# EAGLE design segundo_piso (EAGLE 7.6.0)
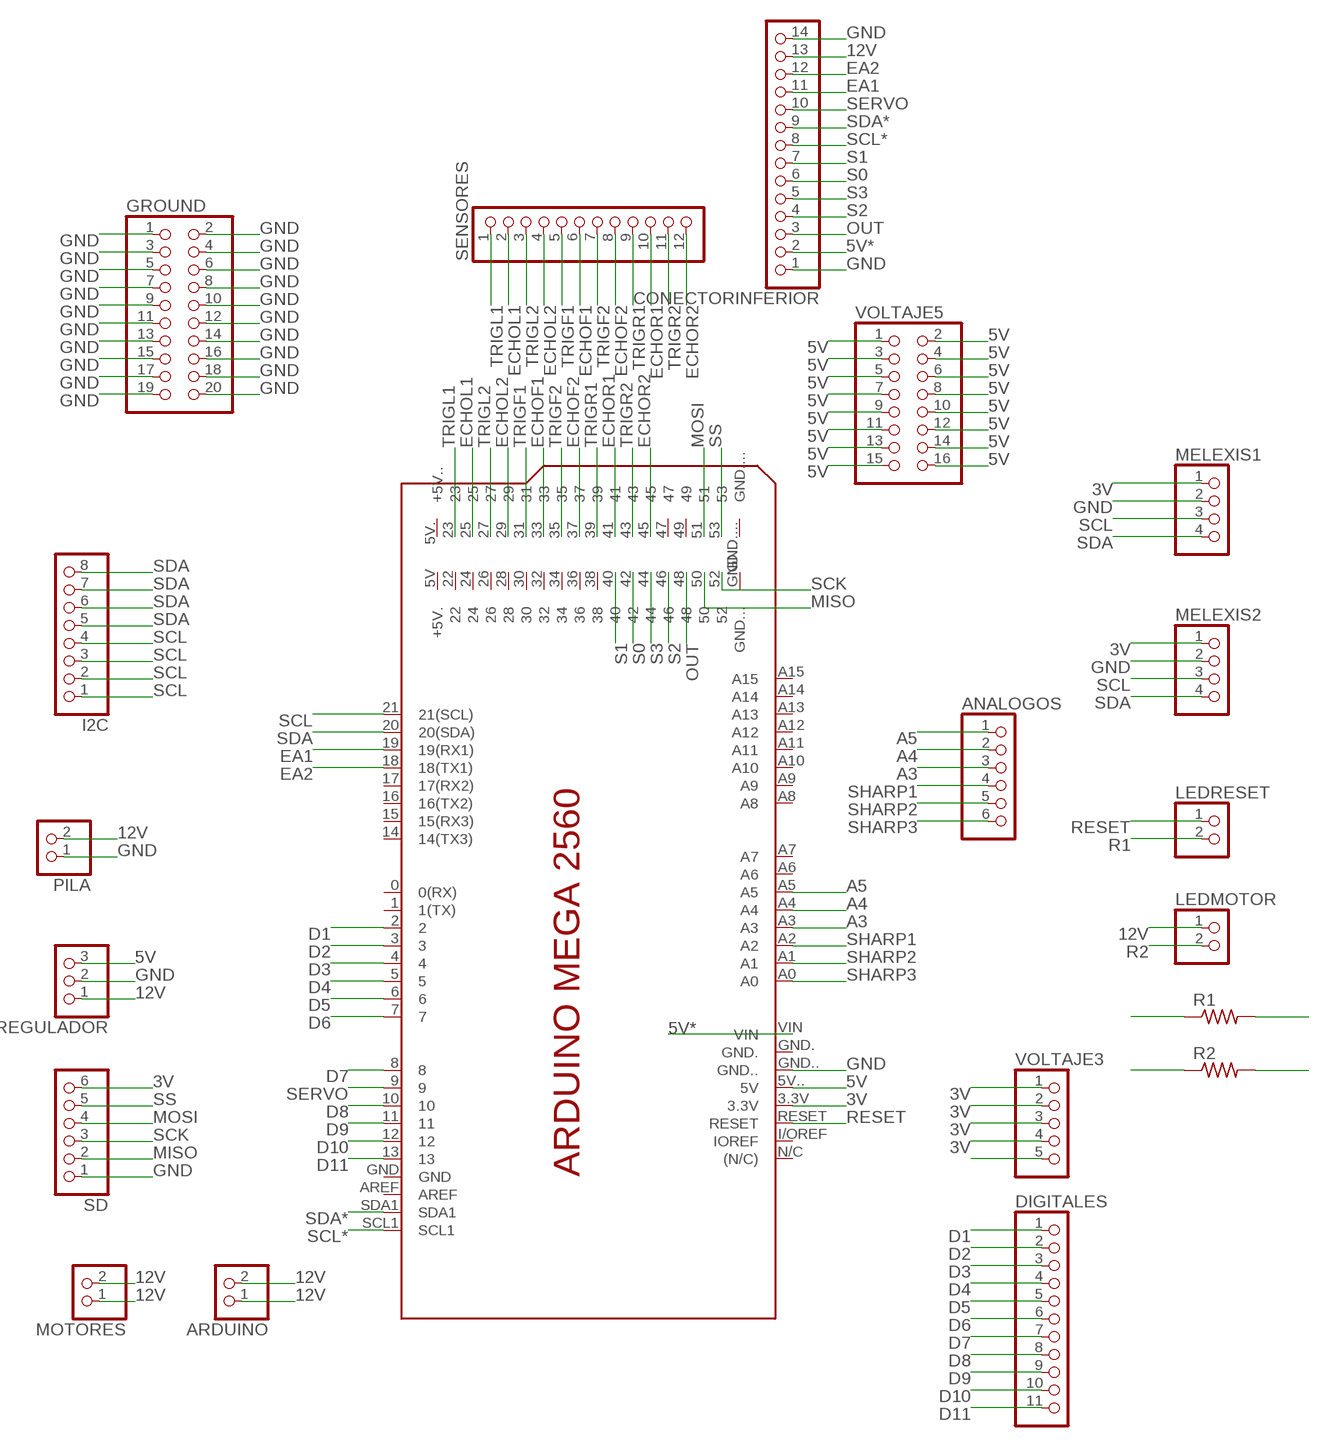
[diagram p0: schematic, sheet 1]

## Parts
ANALOGOS  PINHD-1X6  [1X06]
ARDUINO  PINHD-1X2  [1X02]
CONECTORINFERIOR  PINHD-1X14  [1X14]
DIGITALES  PINHD-1X11  [1X11]
GROUND  PINHD-2X10  [2X10]
I2C  PINHD-1X8  [1X08]
LEDMOTOR  PINHD-1X2  [1X02]
LEDRESET  PINHD-1X2  [1X02]
MEGA1  MEGA  [MEGA]
MELEXIS1  PINHD-1X4  [1X04]
MELEXIS2  PINHD-1X4  [1X04]
MOTORES  PINHD-1X2  [1X02]
PILA  PINHD-1X2  [1X02]
R1  R-US_0204/7  [0204/7]
R2  R-US_0204/7  [0204/7]
REGULADOR  PINHD-1X3  [1X03]
SD  PINHD-1X6  [1X06]
SENSORES  PINHD-1X12  [1X12]
VOLTAJE3  PINHD-1X5  [1X05]
VOLTAJE5  PINHD-2X8  [2X08]

## Nets
3V: MEGA1.3.3V MELEXIS1.1 MELEXIS2.1 SD.6 VOLTAJE3.1 VOLTAJE3.2 VOLTAJE3.3 VOLTAJE3.4
5V: MEGA1.5V..(5V) REGULADOR.3 VOLTAJE5.1 VOLTAJE5.2 VOLTAJE5.3 VOLTAJE5.4 VOLTAJE5.5 VOLTAJE5.6 VOLTAJE5.7 VOLTAJE5.8 VOLTAJE5.9 VOLTAJE5.10 VOLTAJE5.11 VOLTAJE5.12 VOLTAJE5.13 VOLTAJE5.14 VOLTAJE5.15 VOLTAJE5.16
5V*: CONECTORINFERIOR.2 MEGA1.VIN
12V: ARDUINO.1 ARDUINO.2 CONECTORINFERIOR.13 LEDMOTOR.1 MOTORES.1 MOTORES.2 PILA.2 REGULADOR.1
A3: ANALOGOS.3 MEGA1.A3
A4: ANALOGOS.2 MEGA1.A4
A5: ANALOGOS.1 MEGA1.A5
D1: DIGITALES.1 MEGA1.2
D2: DIGITALES.2 MEGA1.3
D3: DIGITALES.3 MEGA1.4
D4: DIGITALES.4 MEGA1.5
D5: DIGITALES.5 MEGA1.6
D6: DIGITALES.6 MEGA1.7
D7: DIGITALES.7 MEGA1.8
D8: DIGITALES.8 MEGA1.10
D9: DIGITALES.9 MEGA1.11
D10: DIGITALES.10 MEGA1.12
D11: DIGITALES.11 MEGA1.13
EA1: CONECTORINFERIOR.11 MEGA1.19(19(RX1))
EA2: CONECTORINFERIOR.12 MEGA1.18(18(TX1))
ECHOF1: MEGA1.33 SENSORES.6
ECHOF2: MEGA1.37 SENSORES.8
ECHOL1: MEGA1.25 SENSORES.2
ECHOL2: MEGA1.29 SENSORES.4
ECHOR1: MEGA1.41 SENSORES.10
ECHOR2: MEGA1.45 SENSORES.12
GND: CONECTORINFERIOR.1 CONECTORINFERIOR.14 GROUND.1 GROUND.2 GROUND.3 GROUND.4 GROUND.5 GROUND.6 GROUND.7 GROUND.8 GROUND.9 GROUND.10 GROUND.11 GROUND.12 GROUND.13 GROUND.14 GROUND.15 GROUND.16 GROUND.17 GROUND.18 GROUND.19 GROUND.20 MEGA1.GND.. MELEXIS1.2 MELEXIS2.2 PILA.1 R1.2 R2.2 REGULADOR.2 SD.1
MISO: MEGA1.50 SD.2
MOSI: MEGA1.51 SD.4
OUT: CONECTORINFERIOR.3 MEGA1.48
R1: LEDRESET.2 R1.1
R2: LEDMOTOR.2 R2.1
RESET: LEDRESET.1 MEGA1.RESET VOLTAJE3.5
S0: CONECTORINFERIOR.6 MEGA1.42
S1: CONECTORINFERIOR.7 MEGA1.40
S2: CONECTORINFERIOR.4 MEGA1.46
S3: CONECTORINFERIOR.5 MEGA1.44
SCK: MEGA1.52 SD.3
SCL: I2C.1 I2C.2 I2C.3 I2C.4 MEGA1.21(21(SCL)) MELEXIS1.3 MELEXIS2.3
SCL*: CONECTORINFERIOR.8 MEGA1.SCL1
SDA: I2C.5 I2C.6 I2C.7 I2C.8 MEGA1.20(20(SDA)) MELEXIS1.4 MELEXIS2.4
SDA*: CONECTORINFERIOR.9 MEGA1.SDA1
SERVO: CONECTORINFERIOR.10 MEGA1.9
SHARP1: ANALOGOS.4 MEGA1.A2
SHARP2: ANALOGOS.5 MEGA1.A1
SHARP3: ANALOGOS.6 MEGA1.A0
SS: MEGA1.53 SD.5
TRIGF1: MEGA1.31 SENSORES.5
TRIGF2: MEGA1.35 SENSORES.7
TRIGL1: MEGA1.23 SENSORES.1
TRIGL2: MEGA1.27 SENSORES.3
TRIGR1: MEGA1.39 SENSORES.9
TRIGR2: MEGA1.43 SENSORES.11
Unconnected: MEGA1.0(0(RX)) MEGA1.1(1(TX)) MEGA1.5V(+5V.) MEGA1.5V.(+5V..) MEGA1.14(14(TX3)) MEGA1.15(15(RX3)) MEGA1.16(16(TX2)) MEGA1.17(17(RX2)) MEGA1.22 MEGA1.24 MEGA1.26 MEGA1.28 MEGA1.30 MEGA1.32 MEGA1.34 MEGA1.36 MEGA1.38 MEGA1.47 MEGA1.49 MEGA1.A6 MEGA1.A7 MEGA1.A8 MEGA1.A9 MEGA1.A10 MEGA1.A11 MEGA1.A12 MEGA1.A13 MEGA1.A14 MEGA1.A15 MEGA1.AREF MEGA1.GND MEGA1.GND. MEGA1.GND... MEGA1.GND.... MEGA1.I/OREF(IOREF) MEGA1.N/C((N/C))

## Library data of the parts
ANALOGOS SD = pinhead:PINHD-1X6: PIN HEADER
ARDUINO LEDMOTOR LEDRESET MOTORES PILA = pinhead:PINHD-1X2: PIN HEADER
CONECTORINFERIOR = pinhead:PINHD-1X14: PIN HEADER
DIGITALES = pinhead:PINHD-1X11: PIN HEADER
GROUND = pinhead:PINHD-2X10: PIN HEADER
I2C = pinhead:PINHD-1X8: PIN HEADER
MEGA1 = ROBORREGOS:MEGA
MELEXIS1 MELEXIS2 = pinhead:PINHD-1X4: PIN HEADER
R1 R2 = resistor:R-US_: RESISTOR, American symbol
REGULADOR = pinhead:PINHD-1X3: PIN HEADER
SENSORES = pinhead:PINHD-1X12: PIN HEADER
VOLTAJE3 = pinhead:PINHD-1X5: PIN HEADER
VOLTAJE5 = pinhead:PINHD-2X8: PIN HEADER

## Board
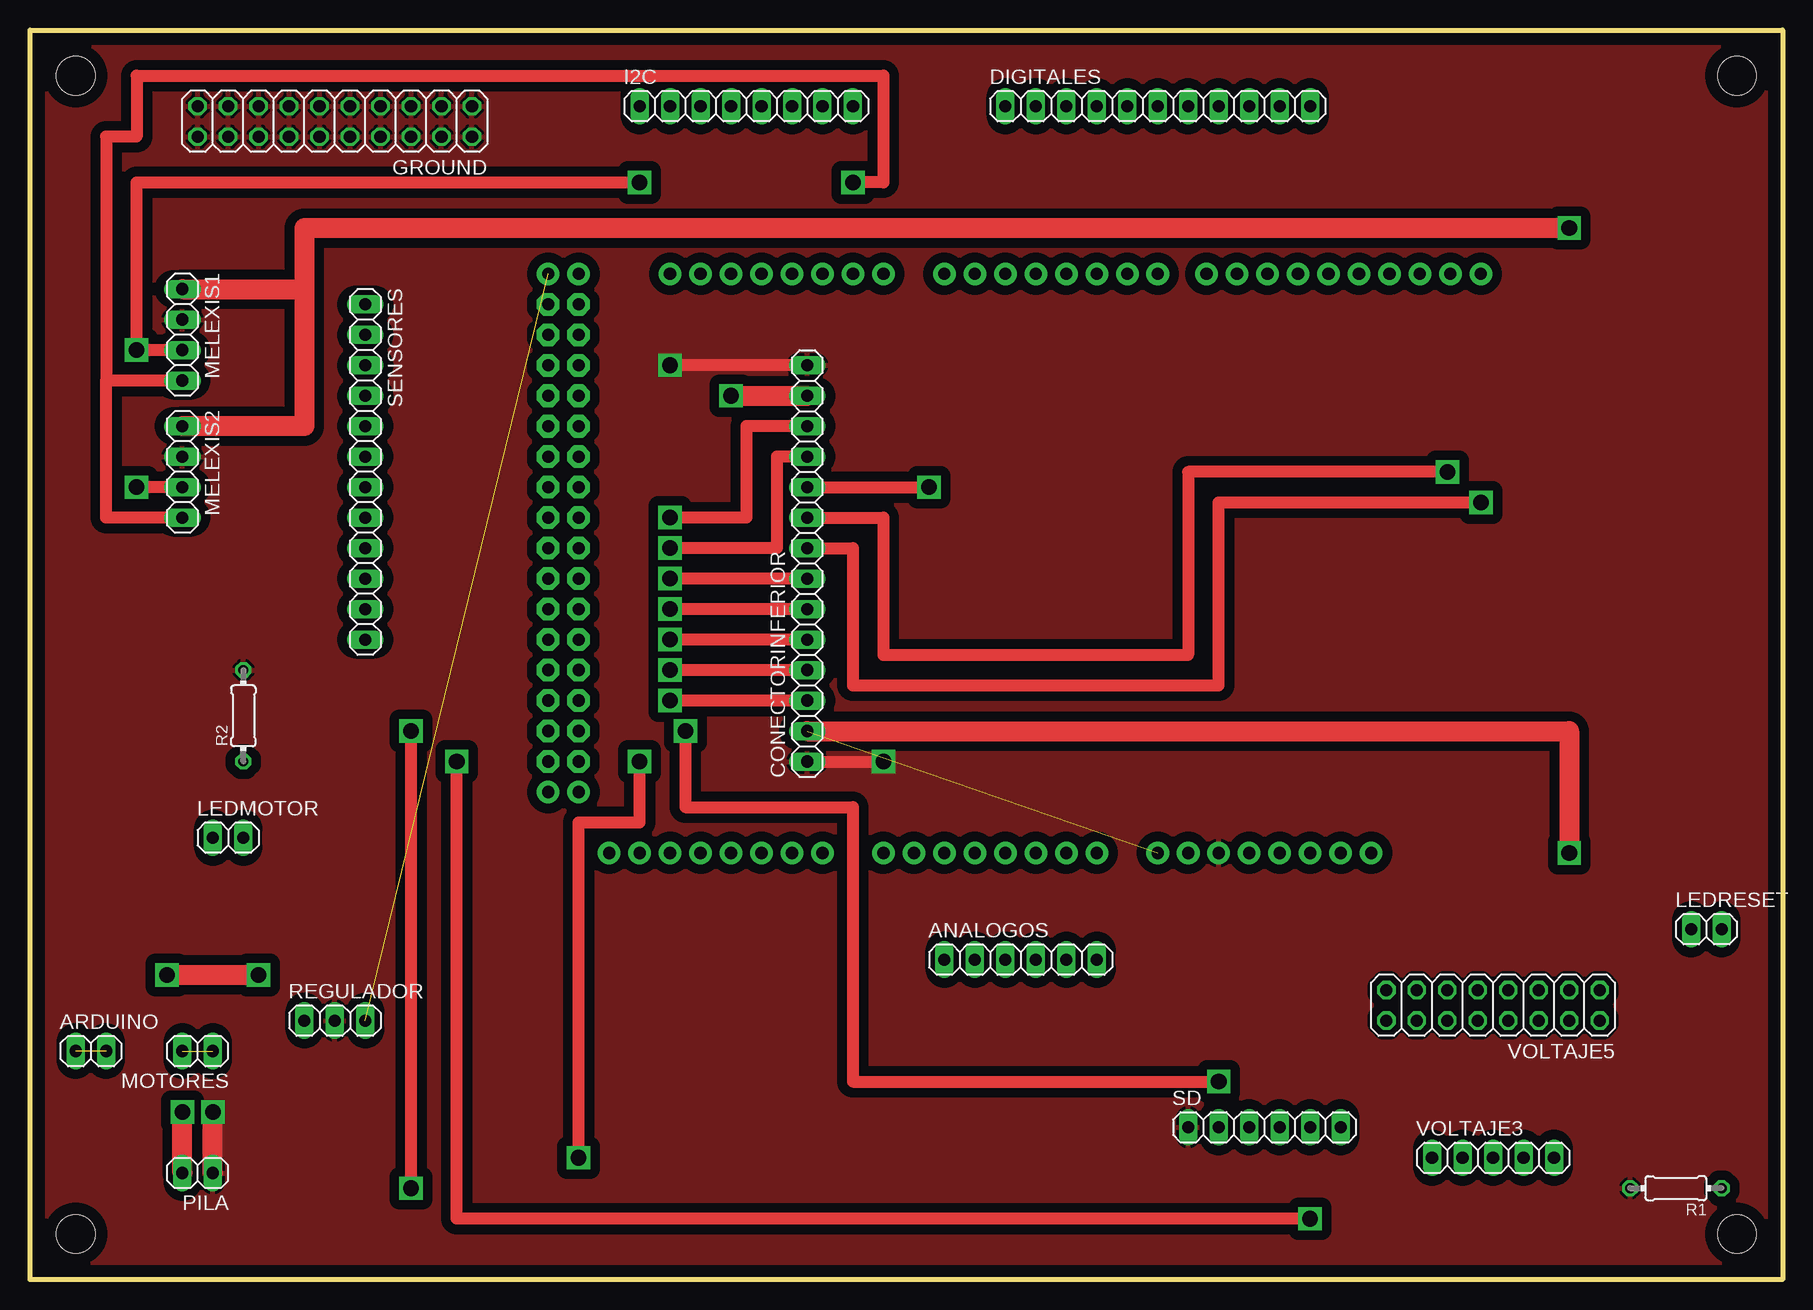
[diagram p1: board, top side]
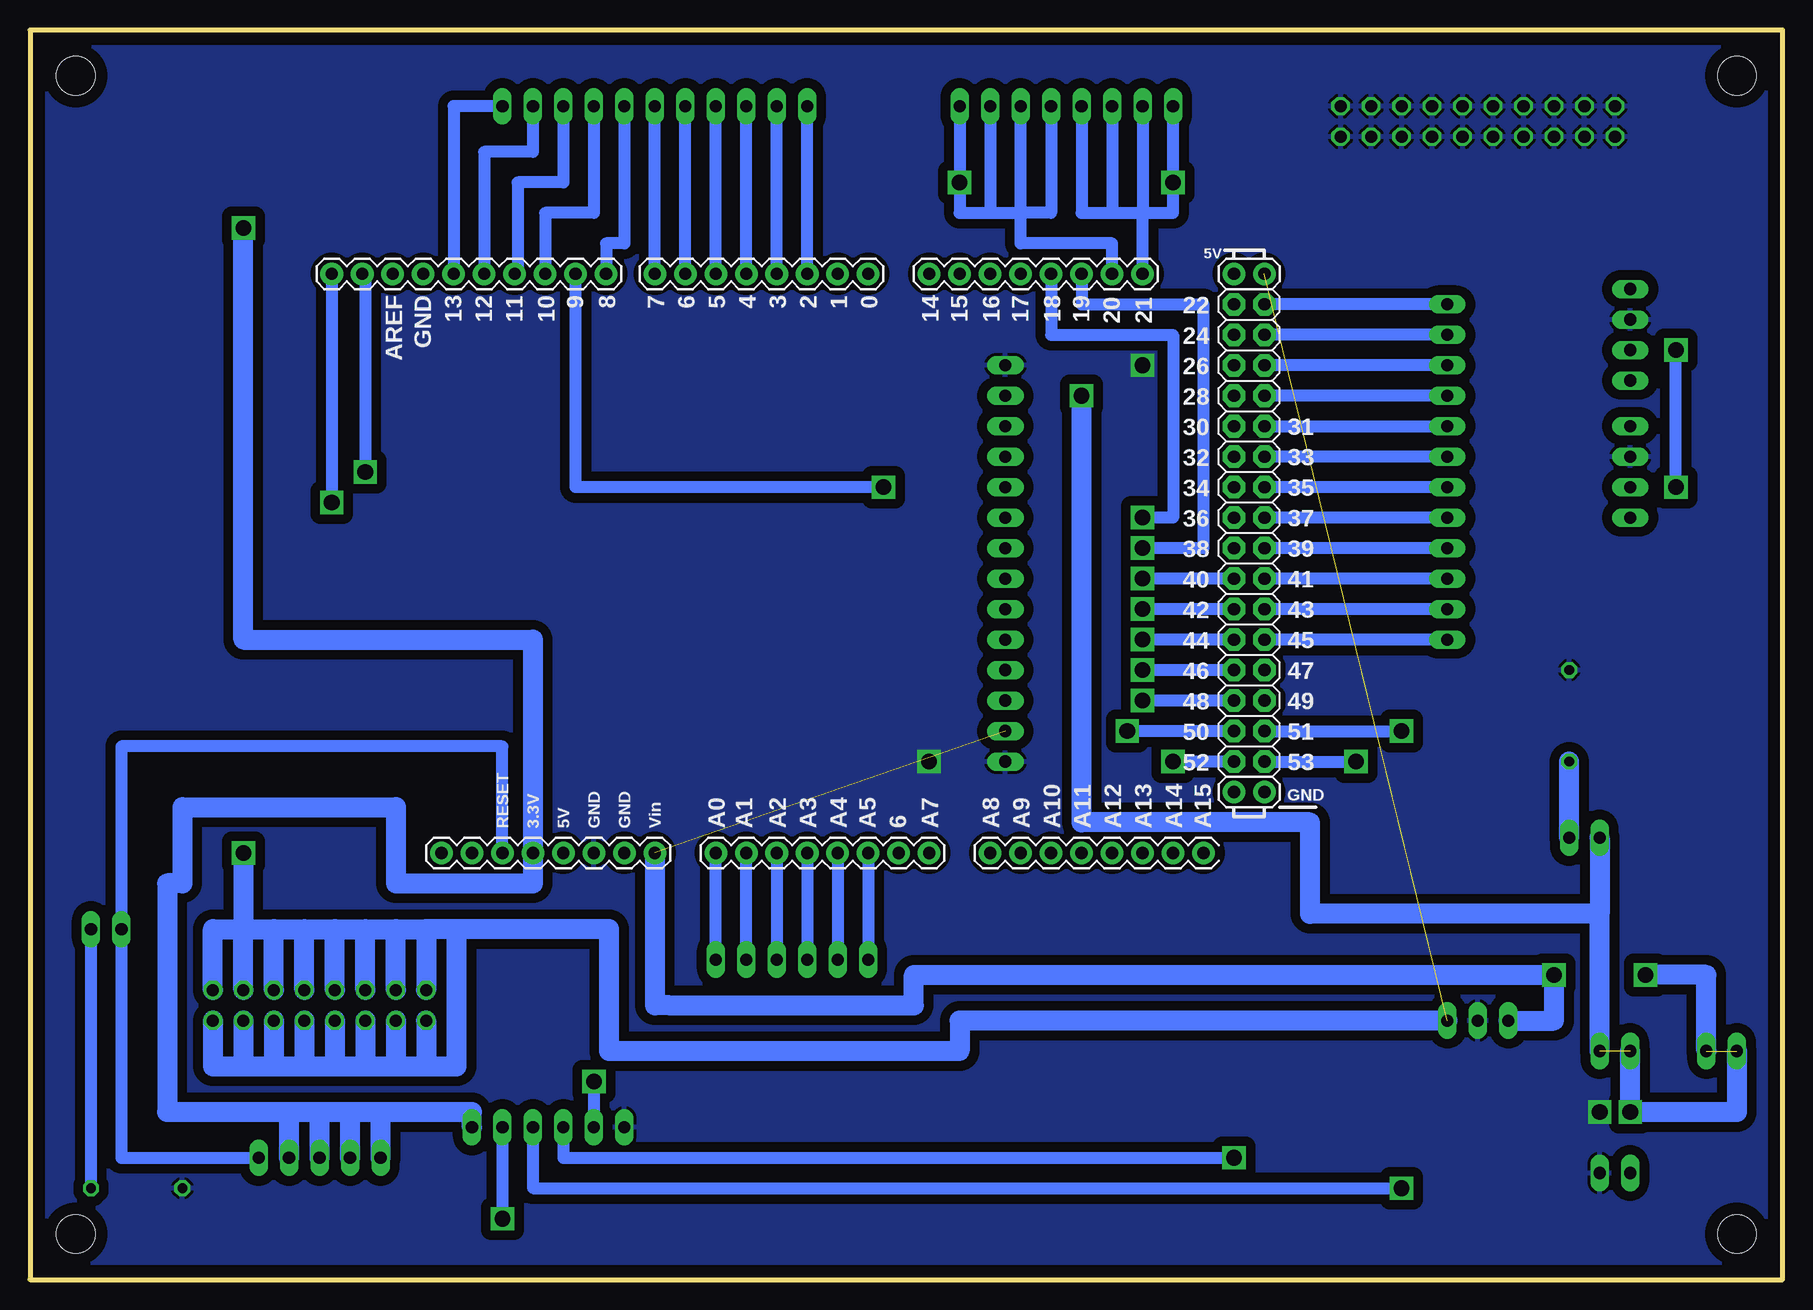
[diagram p2: board, bottom side, seen from below]

Size 146.05 x 104.14 mm. Coordinates in mm from the lower left corner, seen from the top.
Outline: 0,0 0,104.14 146.05,104.14 146.05,0 0,0
Copper layers (1*16): Top 0.035mm / dielectric 1.5mm / Bottom 0.035mm
Design rules "default": minimum track width 10mil, minimum drill 24mil, track to track 8mil, track to pad 8mil, pad to pad 8mil, via to via 8mil, smd to smd 8mil, copper to edge 40mil, drill to drill 8mil, minimum pad ring 10mil, minimum via ring 8mil, stop-mask expansion 4mil, vias tented up to drill 0mil, thermal gap 10mil
Holes 3.2 mm at 3.81,100.33 3.81,3.81 142.24,100.33 142.24,3.81

### Footprints (pad centres in the part's own frame; a part is rotated, then mirrored left to right if it is on the bottom)
1X06 = drill 1.016 long: 1 -6.35,0; 2 -3.81,0; 3 -1.27,0; 4 1.27,0; 5 3.81,0; 6 6.35,0
1X02 = drill 1.016 long: 1 -1.27,0; 2 1.27,0
1X14 = drill 1.016 long: 1 -16.51,0; 2 -13.97,0; 3 -11.43,0; 4 -8.89,0; 5 -6.35,0; 6 -3.81,0; 7 -1.27,0; 8 1.27,0; 9 3.81,0; 10 6.35,0; 11 8.89,0; 12 11.43,0; 13 13.97,0; 14 16.51,0
1X11 = drill 1.016 long: 1 -12.7,0; 2 -10.16,0; 3 -7.62,0; 4 -5.08,0; 5 -2.54,0; 6 0,0; 7 2.54,0; 8 5.08,0; 9 7.62,0; 10 10.16,0; 11 12.7,0
2X10 = drill 1.016 octagon: 1 -11.43,-1.27; 2 -11.43,1.27; 3 -8.89,-1.27; 4 -8.89,1.27; 5 -6.35,-1.27; 6 -6.35,1.27; 7 -3.81,-1.27; 8 -3.81,1.27; 9 -1.27,-1.27; 10 -1.27,1.27; 11 1.27,-1.27; 12 1.27,1.27; 13 3.81,-1.27; 14 3.81,1.27; 15 6.35,-1.27; 16 6.35,1.27; 17 8.89,-1.27; 18 8.89,1.27; 19 11.43,-1.27; 20 11.43,1.27
1X08 = drill 1.016 long: 1 -8.89,0; 2 -6.35,0; 3 -3.81,0; 4 -1.27,0; 5 1.27,0; 6 3.81,0; 7 6.35,0; 8 8.89,0
MEGA = drill 1.016 pad 1.88: 0 16.51,24.13; 1 13.97,24.13; 2 11.43,24.13; 3 8.89,24.13; 3.3V -11.43,-24.13; 4 6.35,24.13; 5 3.81,24.13; 5V -8.89,-24.13; 5V. 46.99,24.13; 5V.. 49.53,24.13; 6 1.27,24.13; 7 -1.27,24.13; 8 -5.334,24.13; 9 -7.874,24.13; 10 -10.414,24.13; 11 -12.954,24.13; 12 -15.494,24.13; 13 -18.034,24.13; 14 21.59,24.13; 15 24.13,24.13; 16 26.67,24.13; 17 29.21,24.13; 18 31.75,24.13; 19 34.29,24.13; 20 36.83,24.13; 21 39.37,24.13; A0 3.81,-24.13; A1 6.35,-24.13; A2 8.89,-24.13; A3 11.43,-24.13; A4 13.97,-24.13; A5 16.51,-24.13; A6 19.05,-24.13; A7 21.59,-24.13; A8 26.67,-24.13; A9 29.21,-24.13; A10 31.75,-24.13; A11 34.29,-24.13; A12 36.83,-24.13; A13 39.37,-24.13; A14 41.91,-24.13; A15 44.45,-24.13; AREF -23.114,24.13; GND -20.574,24.13; GND. -3.81,-24.13; GND.. -6.35,-24.13; GND... 46.99,-19.05; GND.... 49.53,-19.05; I/OREF -16.51,-24.13; N/C -19.05,-24.13; RESET -13.97,-24.13; SCL1 -28.194,24.13; SDA1 -25.654,24.13; VIN -1.27,-24.13 | drill 1.016 pad 1.88 octagon: 22 46.99,21.59; 23 49.53,21.59; 24 46.99,19.05; 25 49.53,19.05; 26 46.99,16.51; 27 49.53,16.51; 28 46.99,13.97; 29 49.53,13.97; 30 46.99,11.43; 31 49.53,11.43; 32 46.99,8.89; 33 49.53,8.89; 34 46.99,6.35; 35 49.53,6.35; 36 46.99,3.81; 37 49.53,3.81; 38 46.99,1.27; 39 49.53,1.27; 40 46.99,-1.27; 41 49.53,-1.27; 42 46.99,-3.81; 43 49.53,-3.81; 44 46.99,-6.35; 45 49.53,-6.35; 46 46.99,-8.89; 47 49.53,-8.89; 48 46.99,-11.43; 49 49.53,-11.43; 50 46.99,-13.97; 51 49.53,-13.97; 52 46.99,-16.51; 53 49.53,-16.51
1X04 = drill 1.016 long: 1 -3.81,0; 2 -1.27,0; 3 1.27,0; 4 3.81,0
0204/7 = drill 0.813 octagon: 1 -3.81,0; 2 3.81,0
1X03 = drill 1.016 long: 1 -2.54,0; 2 0,0; 3 2.54,0
1X12 = drill 1.016 long: 1 -13.97,0; 2 -11.43,0; 3 -8.89,0; 4 -6.35,0; 5 -3.81,0; 6 -1.27,0; 7 1.27,0; 8 3.81,0; 9 6.35,0; 10 8.89,0; 11 11.43,0; 12 13.97,0
1X05 = drill 1.016 long: 1 -5.08,0; 2 -2.54,0; 3 0,0; 4 2.54,0; 5 5.08,0
2X08 = drill 1.016 octagon: 1 -8.89,-1.27; 2 -8.89,1.27; 3 -6.35,-1.27; 4 -6.35,1.27; 5 -3.81,-1.27; 6 -3.81,1.27; 7 -1.27,-1.27; 8 -1.27,1.27; 9 1.27,-1.27; 10 1.27,1.27; 11 3.81,-1.27; 12 3.81,1.27; 13 6.35,-1.27; 14 6.35,1.27; 15 8.89,-1.27; 16 8.89,1.27

### Placement (x,y rotation side)
ANALOGOS  82.55,26.67 0 top
ARDUINO  5.08,19.05 0 top
CONECTORINFERIOR  64.77,59.69 90 top
DIGITALES  93.98,97.79 0 top
GROUND  25.4,96.52 180 top
I2C  59.69,97.79 0 top
LEDMOTOR  16.51,36.83 0 top
LEDRESET  139.7,29.21 0 top
MEGA1  92.71,59.69 0 bottom
MELEXIS1  12.7,78.74 270 top
MELEXIS2  12.7,67.31 270 top
MOTORES  13.97,19.05 180 top
PILA  13.97,8.89 180 top
R1  137.16,7.62 180 top
R2  17.78,46.99 90 top
REGULADOR  25.4,21.59 0 top
SD  102.87,12.7 0 top
SENSORES  27.94,67.31 270 top
VOLTAJE3  121.92,10.16 0 top
VOLTAJE5  121.92,22.86 180 top

### Tracks (layer width: path | path; a pad name or v marks a point on that pad's centre or on a via)
3V  (via drill 1.3)
  Top 1.676: MELEXIS1.1 22.86,82.55 | 22.86,82.55 22.86,71.12 MELEXIS2.1 | v128.27,87.63 22.86,87.63 22.86,82.55
  Bottom 1.676: 124.46,13.97 134.62,13.97 134.62,33.02 133.35,33.02 133.35,39.37 115.57,39.37 115.57,33.02 104.14,33.02 MEGA1.3.3V 104.14,53.34 128.27,53.34 v128.27,87.63 | VOLTAJE3.4 124.46,13.97 | VOLTAJE3.3 121.92,13.97 | 121.92,13.97 124.46,13.97 | VOLTAJE3.2 119.38,13.97 | 119.38,13.97 121.92,13.97 | VOLTAJE3.1 116.84,13.97 | 116.84,13.97 119.38,13.97 | SD.6 109.22,13.97 116.84,13.97
5V  (1 unrouted)
  Bottom 1.676: REGULADOR.3 68.58,21.59 68.58,19.05 97.79,19.05 97.79,29.21 110.49,29.21 | 110.49,29.21 113.03,29.21 | 113.03,29.21 VOLTAJE5.15 | VOLTAJE5.13 115.57,29.21 | 115.57,29.21 113.03,29.21 | VOLTAJE5.11 118.11,29.21 | 118.11,29.21 115.57,29.21 | VOLTAJE5.9 120.65,29.21 | 120.65,29.21 118.11,29.21 | VOLTAJE5.7 123.19,29.21 | 123.19,29.21 120.65,29.21 | VOLTAJE5.5 125.73,29.21 | 125.73,29.21 123.19,29.21 | VOLTAJE5.3 128.27,29.21 | 128.27,29.21 125.73,29.21 | VOLTAJE5.1 130.81,29.21 128.27,29.21 | VOLTAJE5.16 113.03,17.78 | 113.03,17.78 110.49,17.78 110.49,29.21 | VOLTAJE5.14 115.57,17.78 | 115.57,17.78 113.03,17.78 | VOLTAJE5.12 118.11,17.78 | 118.11,17.78 115.57,17.78 | VOLTAJE5.10 120.65,17.78 | 120.65,17.78 118.11,17.78 | VOLTAJE5.8 123.19,17.78 | 123.19,17.78 120.65,17.78 | VOLTAJE5.6 125.73,17.78 | 125.73,17.78 123.19,17.78 | VOLTAJE5.4 128.27,17.78 | 128.27,17.78 125.73,17.78 | VOLTAJE5.2 130.81,17.78 128.27,17.78
5V*  (via drill 1.3)  (1 unrouted)
  Top 1.676: CONECTORINFERIOR.2 128.27,45.72 v128.27,35.56
  Bottom 1.676: v128.27,35.56 128.27,29.21
12V  (via drill 1.3 pad 1.68)  (2 unrouted)
  Top 1.676: PILA.2 v12.7,13.97 | v58.42,73.66 CONECTORINFERIOR.13 | v11.43,25.4 v19.05,25.4
  Bottom 1.676: MOTORES.2 v12.7,13.97 3.81,13.97 ARDUINO.1 | MOTORES.1 15.24,30.48 | 15.24,30.48 39.37,30.48 39.37,38.1 58.42,38.1 v58.42,73.66 | ARDUINO.2 6.35,25.4 v11.43,25.4 | LEDMOTOR.1 15.24,30.48 | REGULADOR.1 19.05,21.59 v19.05,25.4 72.39,25.4 72.39,22.86 92.71,22.86 93.98,22.86 93.98,35.56
A3
  Bottom 1.016: MEGA1.A3 ANALOGOS.3
A4
  Bottom 1.016: MEGA1.A4 ANALOGOS.2
A5
  Bottom 1.016: MEGA1.A5 ANALOGOS.1
D1
  Bottom 1.016: MEGA1.2 DIGITALES.1
D2
  Bottom 1.016: MEGA1.3 DIGITALES.2
D3
  Bottom 1.016: MEGA1.4 DIGITALES.3
D4
  Bottom 1.016: MEGA1.5 DIGITALES.4
D5
  Bottom 1.016: MEGA1.6 DIGITALES.5
D6
  Bottom 1.016: MEGA1.7 DIGITALES.6
D7
  Bottom 1.016: DIGITALES.7 96.52,86.36 98.04,86.36 MEGA1.8
D8
  Bottom 1.016: DIGITALES.8 99.06,88.9 103.12,88.9 MEGA1.10
D9
  Bottom 1.016: DIGITALES.9 101.6,91.44 105.41,91.44 105.41,83.82 MEGA1.11
D10
  Bottom 1.016: DIGITALES.10 104.14,93.98 108.2,93.98 MEGA1.12
D11
  Bottom 1.016: DIGITALES.11 110.74,97.79 MEGA1.13
EA1  (via drill 1.3 pad 1.02)
  Top 1.016: CONECTORINFERIOR.11 62.23,68.58 62.23,60.96 v53.34,60.96
  Bottom 1.016: MEGA1.19 58.42,81.28 48.26,81.28 48.26,60.96 v53.34,60.96
EA2  (via drill 1.3 pad 1.02)
  Top 1.016: CONECTORINFERIOR.12 59.69,71.12 59.69,63.5 v53.34,63.5
  Bottom 1.016: MEGA1.18 60.96,78.74 50.8,78.74 50.8,63.5 v53.34,63.5
ECHOF1
  Bottom 1.016: SENSORES.6 MEGA1.33
ECHOF2
  Bottom 1.016: SENSORES.8 MEGA1.37
ECHOL1
  Bottom 1.016: SENSORES.2 MEGA1.25
ECHOL2
  Bottom 1.016: SENSORES.4 MEGA1.29
ECHOR1
  Bottom 1.016: SENSORES.10 MEGA1.41
ECHOR2
  Bottom 1.016: SENSORES.12 MEGA1.45
GND  (via drill 1.3 pad 1.02, 1.3 pad 1.68)
  Top 1.016: CONECTORINFERIOR.14 v53.34,76.2 | CONECTORINFERIOR.1 v71.12,43.18
  Top 1.676: PILA.1 v15.24,13.97
  pour Top (isolate 0.813): -2.54,106.68 148.59,106.68 148.59,-2.54 -2.54,-2.54
  pour Bottom (isolate 0.813): -2.54,106.68 148.59,106.68 148.59,-2.54 -2.54,-2.54
MISO  (via drill 1.3 pad 1.02)
  Top 1.016: v54.61,45.72 54.61,39.37 68.58,39.37 68.58,16.51 v99.06,16.51
  Bottom 1.016: v99.06,16.51 SD.2 | MEGA1.50 v54.61,45.72
MOSI  (via drill 1.3 pad 1.02)
  Top 1.016: v31.75,7.62 v31.75,45.72
  Bottom 1.016: SD.4 104.14,7.62 v31.75,7.62 | MEGA1.51 v31.75,45.72
OUT  (via drill 1.3 pad 1.02)
  Top 1.016: CONECTORINFERIOR.3 v53.34,48.26
  Bottom 1.016: MEGA1.48 v53.34,48.26
R1
  Bottom 1.016: LEDRESET.2 R1.1
R2
  Bottom 1.676: LEDMOTOR.2 R2.1
RESET
  Bottom 1.016: VOLTAJE3.5 138.43,10.16 LEDRESET.1 138.43,44.45 106.68,44.45 MEGA1.RESET
S0  (via drill 1.3 pad 1.02)
  Top 1.016: CONECTORINFERIOR.6 v53.34,55.88
  Bottom 1.016: MEGA1.42 v53.34,55.88
S1  (via drill 1.3 pad 1.02)
  Top 1.016: CONECTORINFERIOR.7 v53.34,58.42
  Bottom 1.016: MEGA1.40 v53.34,58.42
S2  (via drill 1.3 pad 1.02)
  Top 1.016: CONECTORINFERIOR.4 v53.34,50.8
  Bottom 1.016: MEGA1.46 v53.34,50.8
S3  (via drill 1.3 pad 1.02)
  Top 1.016: CONECTORINFERIOR.5 v53.34,53.34
  Bottom 1.016: MEGA1.44 v53.34,53.34
SCK  (via drill 1.3 pad 1.02)
  Top 1.016: v45.72,10.16 45.72,38.1 50.8,38.1 v50.8,43.18
  Bottom 1.016: SD.3 101.6,10.16 v45.72,10.16 | MEGA1.52 v50.8,43.18
SCL  (via drill 1.3)
  Top 1.016: MELEXIS1.3 v8.89,77.47 8.89,91.44 v50.8,91.44 | MELEXIS2.3 v8.89,66.04
  Bottom 1.016: 53.34,88.9 50.8,88.9 v50.8,91.44 I2C.1 | I2C.2 53.34,88.9 | I2C.3 55.88,88.9 | 55.88,88.9 53.34,88.9 | I2C.4 58.42,88.9 55.88,88.9 | v8.89,66.04 v8.89,77.47 | MEGA1.21 53.34,88.9
SCL*  (via drill 1.3)
  Top 1.016: CONECTORINFERIOR.8 68.58,60.96 68.58,49.53 99.06,49.53 99.06,64.77 v120.9,64.77
  Bottom 1.016: MEGA1.SCL1 v120.9,64.77
SDA  (via drill 1.3)
  Top 1.016: MELEXIS1.4 6.35,74.93 | v68.58,91.44 71.12,91.44 71.12,100.33 8.89,100.33 8.89,95.25 6.35,95.25 6.35,74.93 | MELEXIS2.4 6.35,63.5 6.35,74.93
  Bottom 1.016: 63.5,88.9 63.5,86.36 55.88,86.36 MEGA1.20 | 63.5,88.9 I2C.6 | I2C.5 60.96,88.9 63.5,88.9 | I2C.7 66.04,88.9 | 66.04,88.9 63.5,88.9 | I2C.8 v68.58,91.44 68.58,88.9 66.04,88.9
SDA*  (via drill 1.3 pad 1.02)
  Top 1.016: v118.11,67.31 96.52,67.31 96.52,52.07 71.12,52.07 71.12,63.5 CONECTORINFERIOR.9
  Bottom 1.016: v118.11,67.31 118.11,82.55 118.11,83.82 MEGA1.SDA1
SERVO  (via drill 1.3)
  Top 1.016: CONECTORINFERIOR.10 v74.93,66.04
  Bottom 1.016: v74.93,66.04 100.58,66.04 MEGA1.9
SHARP1
  Bottom 1.016: MEGA1.A2 ANALOGOS.4
SHARP2
  Bottom 1.016: ANALOGOS.5 MEGA1.A1
SHARP3
  Bottom 1.016: ANALOGOS.6 MEGA1.A0
SS  (via drill 1.3 pad 1.02)
  Top 1.016: v106.68,5.08 35.56,5.08 v35.56,43.18
  Bottom 1.016: SD.5 v106.68,5.08 | MEGA1.53 v35.56,43.18
TRIGF1
  Bottom 1.016: MEGA1.31 SENSORES.5
TRIGF2
  Bottom 1.016: SENSORES.7 MEGA1.35
TRIGL1
  Bottom 1.016: SENSORES.1 MEGA1.23
TRIGL2
  Bottom 1.016: SENSORES.3 MEGA1.27
TRIGR1
  Bottom 1.016: SENSORES.9 MEGA1.39
TRIGR2
  Bottom 1.016: SENSORES.11 MEGA1.43